# Altium schematic sheet 拉低1.8V.SchDoc
size A4
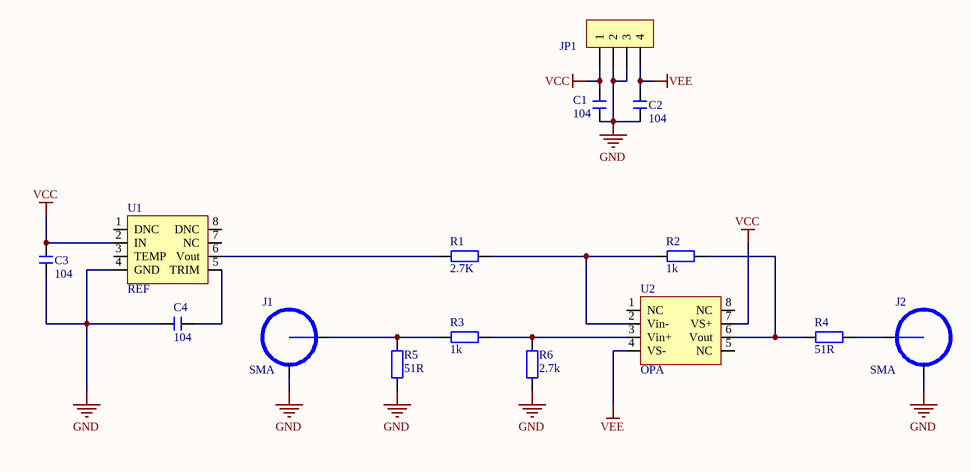
[diagram p0: 拉低1.8V.SchDoc]

## Parts
C1  104  [C 0805_L]
C2  104  [C 0805_L]
C3  104  [C 0805_L]
C4  104  [C 0805_L]
J1  SMA  [HDR2.54-LI-2P]
J2  SMA  [HDR2.54-LI-2P]
JP1  HDR-1X4  [KF2510-LI-4P]  (value not drawn)
R1  2.7K  [R 0805_L]
R2  1k  [R 0805_L]
R3  1k  [R 0805_L]
R4  51R  [R 0805_L]
R5  51R  [R 0805_L]
R6  2.7k  [R 0805_L]
U1  REF  [SOP8_M]
U2  OPA  [SOP8_M]

## Nets
GND: C1.1 C2.1 C3.1 C4.2 J1.2 J2.2 JP1.2 JP1.3 R5.1 R6.1 U1.4(GND)
VCC: C1.2 C3.2 JP1.1 U1.2(IN) U2.7(VS+)
VEE: C2.2 JP1.4 U2.4(VS-)
NetC4_1: C4.1 U1.5(TRIM)
NetJ1_1: J1.1 R3.1 R5.2
NetJ2_1: J2.1 R4.2
NetR1_1: R1.1 U1.6(Vout)
NetR1_2: R1.2 R2.1 U2.2(Vin-)
NetR2_2: R2.2 R4.1 U2.6(Vout)
NetR3_2: R3.2 R6.2 U2.3(Vin+)

Not connected (* = marked no-connect by the designer): U1 1(DNC) 3(TEMP) 7(NC) 8(DNC); U2 1(NC) 5(NC) 8(NC)

## Library data of the parts
C1-C4 = C: 无极性贴片电容; 版权归属: 源创客; BOM名称: 无极性贴片电容; 学习资源: www.ooocke.com
JP1 = Header 4: 4P接插件; 版权归属: 源创客; BOM名称: 4P接插件; 学习资源: www.ooocke.com
R1-R6 = R: 贴片电阻; 版权归属: 源创客; BOM名称: 贴片电阻; 学习资源: www.ooocke.com
U1 U2 = 单运放